# Altium schematic sheet MainBoard_MCUBreakout.SchDoc
size B
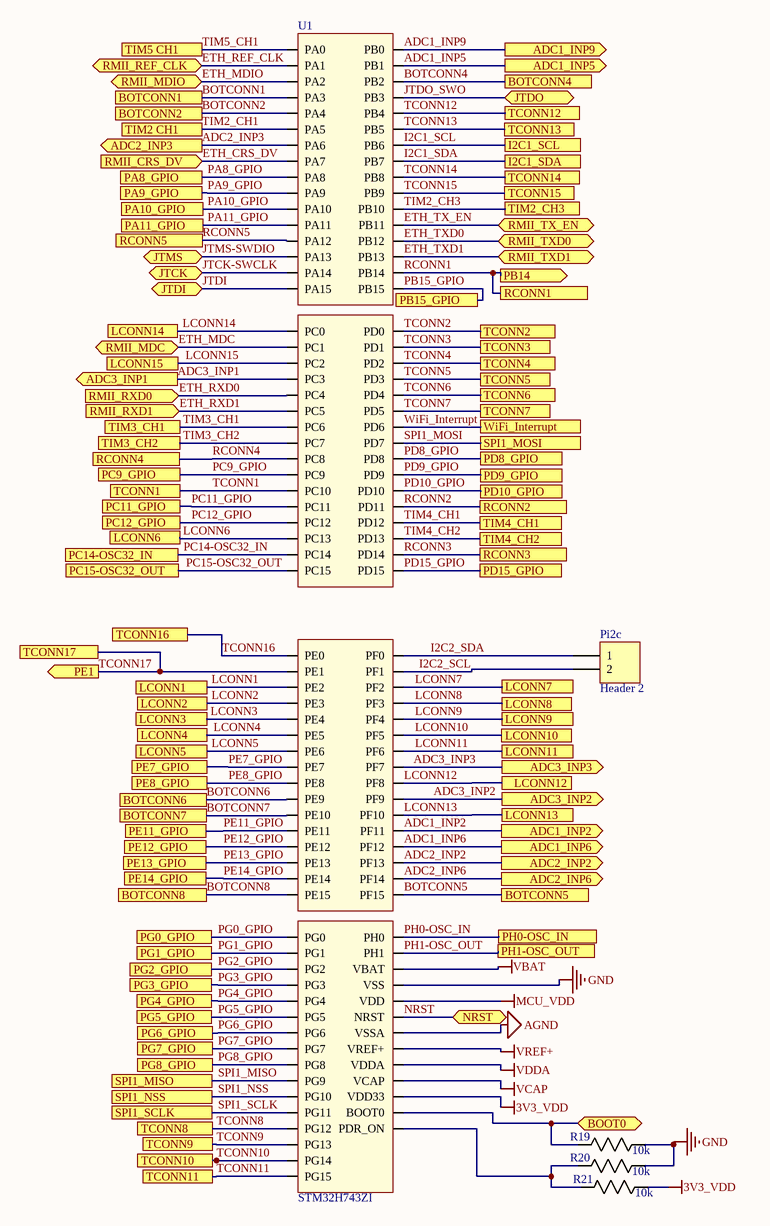
[diagram p0: MainBoard_MCUBreakout.SchDoc]

## Parts
Pi2c  Header 2  [HDR1X2]
R19  10k  [0805]
R20  10k  [0805]
R21  10k  [0805]
U1  STM32H743ZI  [STM32H7]

## Ports
ADC1_INP2 (out), ADC1_INP5 (out), ADC1_INP6 (out), ADC1_INP9 (out), ADC2_INP2 (out), ADC2_INP3 (out), ADC2_INP6 (out), ADC3_INP1 (out), ADC3_INP2 (out), ADC3_INP3 (out), BOOT0 (bidir), BOTCONN1, BOTCONN2, BOTCONN4, BOTCONN5, BOTCONN6, BOTCONN7, BOTCONN8, I2C1_SCL, I2C1_SDA, JTCK (bidir), JTDI (bidir), JTDO (bidir), JTMS (bidir), LCONN1, LCONN2, LCONN3, LCONN4, LCONN5, LCONN6, LCONN7, LCONN8, LCONN9, LCONN10, LCONN11, LCONN12, LCONN13, LCONN14, LCONN15, NRST (bidir), PA8_GPIO, PA9_GPIO, PA10_GPIO, PA11_GPIO, PB14 (out), PB15_GPIO, PC9_GPIO, PC11_GPIO, PC12_GPIO, PC14-OSC32_IN, PC15-OSC32_OUT, PD8_GPIO, PD9_GPIO, PD10_GPIO, PD15_GPIO, PE1 (out), PE7_GPIO, PE8_GPIO, PE11_GPIO, PE12_GPIO, PE13_GPIO, PE14_GPIO, PG0_GPIO, PG1_GPIO, PG2_GPIO, PG3_GPIO, PG4_GPIO, PG5_GPIO, PG6_GPIO, PG7_GPIO, PG8_GPIO, PH0-OSC_IN, PH1-OSC_OUT, RCONN1, RCONN2, RCONN3, RCONN4, RCONN5, RMII_CRS_DV (in), RMII_MDC (bidir), RMII_MDIO (bidir), RMII_REF_CLK (bidir), RMII_RXD0 (in), RMII_RXD1 (in), RMII_TX_EN (bidir), RMII_TXD0 (bidir), RMII_TXD1 (bidir), SPI1_MISO, SPI1_MOSI, SPI1_NSS, SPI1_SCLK, TCONN1, TCONN2, TCONN3, TCONN4, TCONN5, TCONN6, TCONN7, TCONN8, TCONN9, TCONN10, TCONN11, TCONN12, TCONN13, TCONN14, TCONN15, TCONN16, TCONN17, TIM2 CH1, TIM2_CH3, TIM3_CH1, TIM3_CH2, TIM4_CH1, TIM4_CH2, TIM5 CH1, WiFi_Interrupt

## Nets
3V3_VDD: R21.1(R1) U1.VDD33USB(VDD33)
AGND: U1.VSSA
GND: R19.1(R1) R20.1(R1) U1.VSS
MCU_VDD: U1.VDD
VBAT: U1.VBAT
VCAP: U1.VCAP
VDDA: U1.VDDA
VREF+: U1.VREF+
ADC1_INP2: U1.PF11 ; port ADC1_INP2
ADC1_INP5: U1.PB1 ; port ADC1_INP5
ADC1_INP6: U1.PF12 ; port ADC1_INP6
ADC1_INP9: U1.PB0 ; port ADC1_INP9
ADC2_INP2: U1.PF13 ; port ADC2_INP2
ADC2_INP3: U1.PA6 ; port ADC2_INP3
ADC2_INP6: U1.PF14 ; port ADC2_INP6
ADC3_INP1: U1.PC3 ; port ADC3_INP1
ADC3_INP2: U1.PF9 ; port ADC3_INP2
ADC3_INP3: U1.PF7 ; port ADC3_INP3
BOOT0: R19.2(R2) U1.BOOT0 ; port BOOT0
BOTCONN1: U1.PA3 ; port BOTCONN1
BOTCONN2: U1.PA4 ; port BOTCONN2
BOTCONN4: U1.PB2 ; port BOTCONN4
BOTCONN5: U1.PF15 ; port BOTCONN5
BOTCONN6: U1.PE9 ; port BOTCONN6
BOTCONN7: U1.PE10 ; port BOTCONN7
BOTCONN8: U1.PE15 ; port BOTCONN8
ETH_CRS_DV: U1.PA7 ; port RMII_CRS_DV
ETH_MDC: U1.PC1 ; port RMII_MDC
ETH_MDIO: U1.PA2 ; port RMII_MDIO
ETH_REF_CLK: U1.PA1 ; port RMII_REF_CLK
ETH_RXD0: U1.PC4 ; port RMII_RXD0
ETH_RXD1: U1.PC5 ; port RMII_RXD1
ETH_TX_EN: U1.PB11 ; port RMII_TX_EN
ETH_TXD0: U1.PB12 ; port RMII_TXD0
ETH_TXD1: U1.PB13 ; port RMII_TXD1
I2C1_SCL: U1.PB6 ; port I2C1_SCL
I2C1_SDA: U1.PB7 ; port I2C1_SDA
I2C2_SCL: Pi2c.2 U1.PF1
I2C2_SDA: Pi2c.1 U1.PF0
JTCK-SWCLK: U1.PA14 ; port JTCK
JTDI: U1.PA15 ; port JTDI
JTDO_SWO: U1.PB3 ; port JTDO
JTMS-SWDIO: U1.PA13 ; port JTMS
LCONN1: U1.PE2 ; port LCONN1
LCONN2: U1.PE3 ; port LCONN2
LCONN3: U1.PE4 ; port LCONN3
LCONN4: U1.PE5 ; port LCONN4
LCONN5: U1.PE6 ; port LCONN5
LCONN6: U1.PC13 ; port LCONN6
LCONN7: U1.PF2 ; port LCONN7
LCONN8: U1.PF3 ; port LCONN8
LCONN9: U1.PF4 ; port LCONN9
LCONN10: U1.PF5 ; port LCONN10
LCONN11: U1.PF6 ; port LCONN11
LCONN12: U1.PF8 ; port LCONN12
LCONN13: U1.PF10 ; port LCONN13
LCONN14: U1.PC0 ; port LCONN14
LCONN15: U1.PC2 ; port LCONN15
NRST: U1.NRST ; port NRST
PA8_GPIO: U1.PA8 ; port PA8_GPIO
PA9_GPIO: U1.PA9 ; port PA9_GPIO
PA10_GPIO: U1.PA10 ; port PA10_GPIO
PA11_GPIO: U1.PA11 ; port PA11_GPIO
PB15_GPIO: U1.PB15 ; port PB15_GPIO
PC9_GPIO: U1.PC9 ; port PC9_GPIO
PC11_GPIO: U1.PC11 ; port PC11_GPIO
PC12_GPIO: U1.PC12 ; port PC12_GPIO
PC14-OSC32_IN: U1.PC14 ; port PC14-OSC32_IN
PC15-OSC32_OUT: U1.PC15 ; port PC15-OSC32_OUT
PD8_GPIO: U1.PD8 ; port PD8_GPIO
PD9_GPIO: U1.PD9 ; port PD9_GPIO
PD10_GPIO: U1.PD10 ; port PD10_GPIO
PD15_GPIO: U1.PD15 ; port PD15_GPIO
PE7_GPIO: U1.PE7 ; port PE7_GPIO
PE8_GPIO: U1.PE8 ; port PE8_GPIO
PE11_GPIO: U1.PE11 ; port PE11_GPIO
PE12_GPIO: U1.PE12 ; port PE12_GPIO
PE13_GPIO: U1.PE13 ; port PE13_GPIO
PE14_GPIO: U1.PE14 ; port PE14_GPIO
PG0_GPIO: U1.PG0 ; port PG0_GPIO
PG1_GPIO: U1.PG1 ; port PG1_GPIO
PG2_GPIO: U1.PG2 ; port PG2_GPIO
PG3_GPIO: U1.PG3 ; port PG3_GPIO
PG4_GPIO: U1.PG4 ; port PG4_GPIO
PG5_GPIO: U1.PG5 ; port PG5_GPIO
PG6_GPIO: U1.PG6 ; port PG6_GPIO
PG7_GPIO: U1.PG7 ; port PG7_GPIO
PG8_GPIO: U1.PG8 ; port PG8_GPIO
PH0-OSC_IN: U1.PH0 ; port PH0-OSC_IN
PH1-OSC_OUT: U1.PH1 ; port PH1-OSC_OUT
RCONN1: U1.PB14 ; port PB14, port RCONN1
RCONN2: U1.PD11 ; port RCONN2
RCONN3: U1.PD14 ; port RCONN3
RCONN4: U1.PC8 ; port RCONN4
RCONN5: U1.PA12 ; port RCONN5
SPI1_MISO: U1.PG9 ; port SPI1_MISO
SPI1_MOSI: U1.PD7 ; port SPI1_MOSI
SPI1_NSS: U1.PG10 ; port SPI1_NSS
SPI1_SCLK: U1.PG11 ; port SPI1_SCLK
TCONN1: U1.PC10 ; port TCONN1
TCONN2: U1.PD0 ; port TCONN2
TCONN3: U1.PD1 ; port TCONN3
TCONN4: U1.PD2 ; port TCONN4
TCONN5: U1.PD3 ; port TCONN5
TCONN6: U1.PD4 ; port TCONN6
TCONN7: U1.PD5 ; port TCONN7
TCONN8: U1.PG12 ; port TCONN8
TCONN9: U1.PG13 ; port TCONN9
TCONN10: U1.PG14 ; port TCONN10
TCONN11: U1.PG15 ; port TCONN11
TCONN12: U1.PB4 ; port TCONN12
TCONN13: U1.PB5 ; port TCONN13
TCONN14: U1.PB8 ; port TCONN14
TCONN15: U1.PB9 ; port TCONN15
TCONN16: U1.PE0 ; port TCONN16
TCONN17: U1.PE1 ; port PE1, port TCONN17
TIM2_CH1: U1.PA5 ; port TIM2 CH1
TIM2_CH3: U1.PB10 ; port TIM2_CH3
TIM3_CH1: U1.PC6 ; port TIM3_CH1
TIM3_CH2: U1.PC7 ; port TIM3_CH2
TIM4_CH1: U1.PD12 ; port TIM4_CH1
TIM4_CH2: U1.PD13 ; port TIM4_CH2
TIM5_CH1: U1.PA0 ; port TIM5 CH1
WiFi_Interrupt: U1.PD6 ; port WiFi_Interrupt
NetR20_2: R20.2(R2) R21.2(R2) U1.PDR_ON

## Library data of the parts
Pi2c = Header 2: Header, 2-Pin; LatestRevisionDate: 17-Jul-2002; LatestRevisionNote: Re-released for DXP Platform.; Publisher: Altium Limited
R19-R21 = RES 10k 0805: RES SMD 10K OHM 1% 1/8W 0805; MP: RC0805FR-0710KL; MF: Yageo; Rating: 0.125W; Digikey: 311-10.0KCRCT-ND; Price: 0.061 CAD; Package: 0805; Value: 10k; Digikey Link: https://www.digikey.ca/products/en?keywords=311-10.0KCRCT-ND; Tolerance: 1%
U1 = STM32H743ZI: MF: STMicroelectronics; MP: STM32H743ZIT6; Digikey: 497-17721-ND; Digikey Link: https://www.digikey.ca/product-detail/en/stmicroelectronics/STM32H743ZIT6/497-17721-ND/7809238; Package: 144-LQFP (20x20)